# Altium project Luchador Rev 3.2.PrjPcb (part 1 of 4)
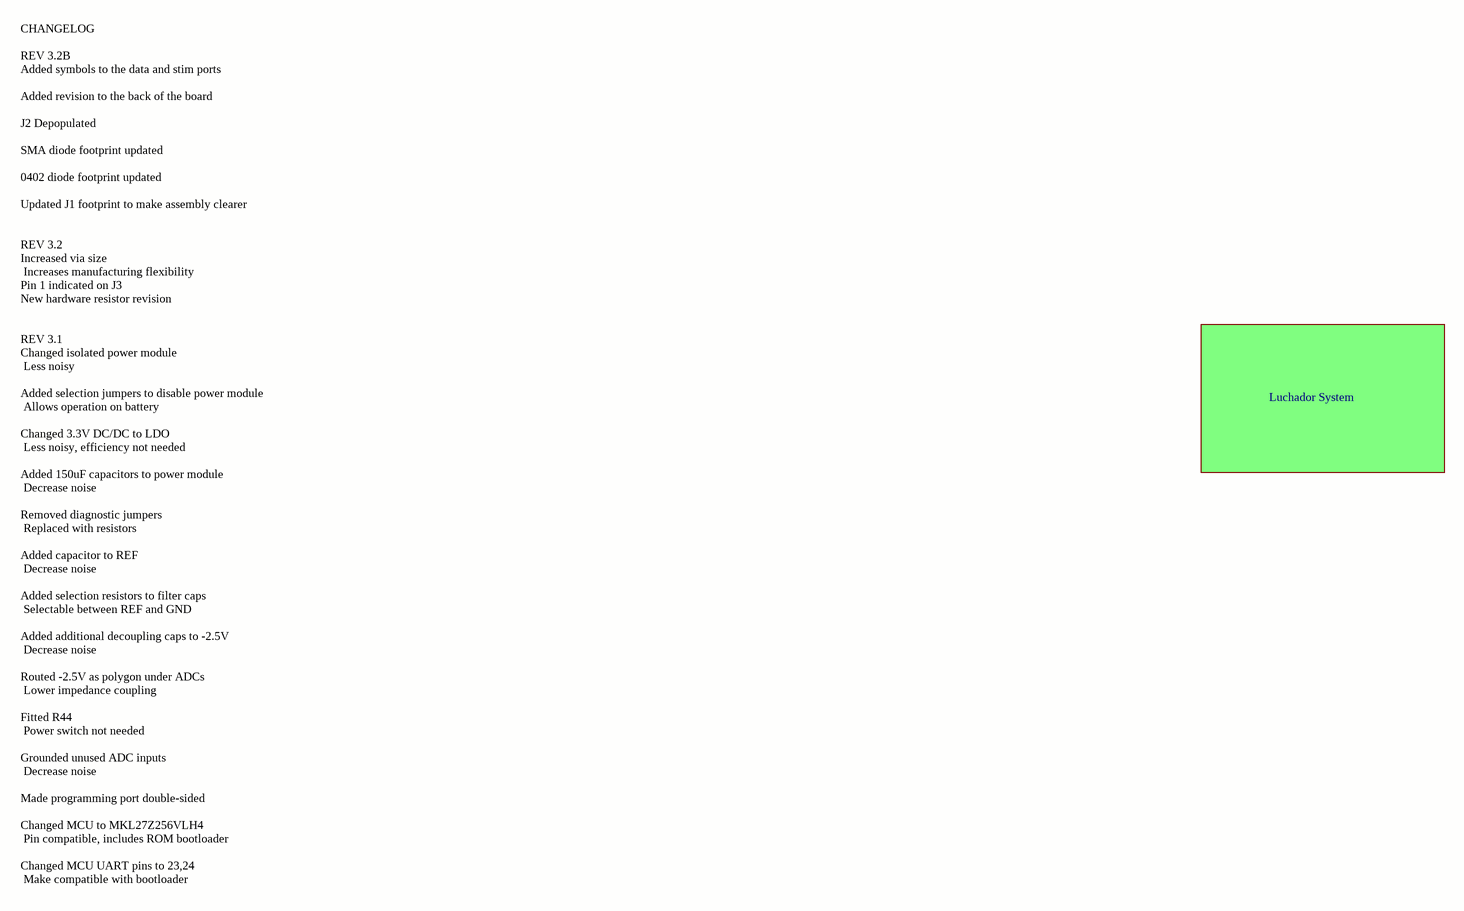
[diagram p0: Cover Sheet.SchDoc]
DocNumberSCH: 650-02461-01; PCBDOC: XXXXXX; PCBPN: 651-02461-01; PCBREV: 3.2b; PRJCOMPANY: X; PRJDATE: 3-15-19; PRJDOC: XXXXXX; PRJENGINEER: N. HAMAN; PRJNAME: AMBER; PRJREV: 3.2b
8 sheets, 149 parts. Net scope: flat (ports and power ports of the same name join across sheets).
Board file: Luchador Pcb.PcbDoc
Sheets:
  Cover Sheet.SchDoc
    Luchador System = System.SchDoc
      Power Supply/Charger = Power Supply.SchDoc
      MCU = Microcontroller.SchDoc
      RTC = Real Time Clock.SchDoc
      MICRO SD = Micro SD.SchDoc
  8CH EEG.SchDoc
  Differential Channel Protection.SchDoc

## Sheet Cover Sheet.SchDoc
size B; SheetNumber: 1; SheetTotal: 11; TitleBlk1Sch: PCBA, LUCHADOR, REV 3.2b, AMBER; TitleBlk2Sch: Luchador System; RevSch: 01; EngDate: 3-15-2019; Eng: Haman/Seto

### Sub-sheets
Luchador System = System.SchDoc: no entries

### Notes on the sheet
- CHANGELOG
  REV 3.2B
  Added symbols to the data and stim ports
  Added revision to the back of the board
  J2 Depopulated
  SMA diode footprint updated
  0402 diode footprint updated
  Updated J1 footprint to make assembly clearer
  REV 3.2
  Increased via size
  Increases manufacturing flexibility
  Pin 1 indicated on J3
  New hardware resistor revision
  REV 3.1
  Changed isolated power module
  Less noisy
  Added selection jumpers to disable power module
  Allows operation on battery
  Changed 3.3V DC/DC to LDO
  Less noisy, efficiency not needed
  Added 150uF capacitors to power module
  Decrease noise
  Removed diagnostic jumpers
  Replaced with resistors
  Added capacitor to REF
  Decrease noise
  Added selection resistors to filter caps
  Selectable between REF and GND
  Added additional decoupling caps to -2.5V
  Decrease noise
  Routed -2.5V as polygon under ADCs
  Lower impedance coupling
  Fitted R44
  Power switch not needed
  Grounded unused ADC inputs
  Decrease noise
  Made programming port double-sided
  Changed MCU to MKL27Z256VLH4
  Pin compatible, includes ROM bootloader
  Changed MCU UART pins to 23,24
  Make compatible with bootloader
  Moved START signal to pin 41
  Original pin was NMI pin
  Added MCU hardware version resistors
  Added force bootloader jumper
  Allows image update without JTAG
  REV 3.0
  New Release
- Title:
- USA
- 100 Mayfield Avenue
- Mountain View, CA 94043
- Variant Name:
- Confidential and Proprietary
- Engineer:
- Date:
- Size:
- B
- Template:
- 992-00283-00 A
- Dwg No:
- Sheet:
- Rev:
- of

## Sheet System.SchDoc
size B; SheetNumber: 2; SheetTotal: 11; TitleBlk1Sch: PCBA, LUCHADOR, REV 3.2b, AMBER; Eng: Haman/Seto; EngDate: 3-15-19; TitleBlk2Sch: System; RevSch: 01
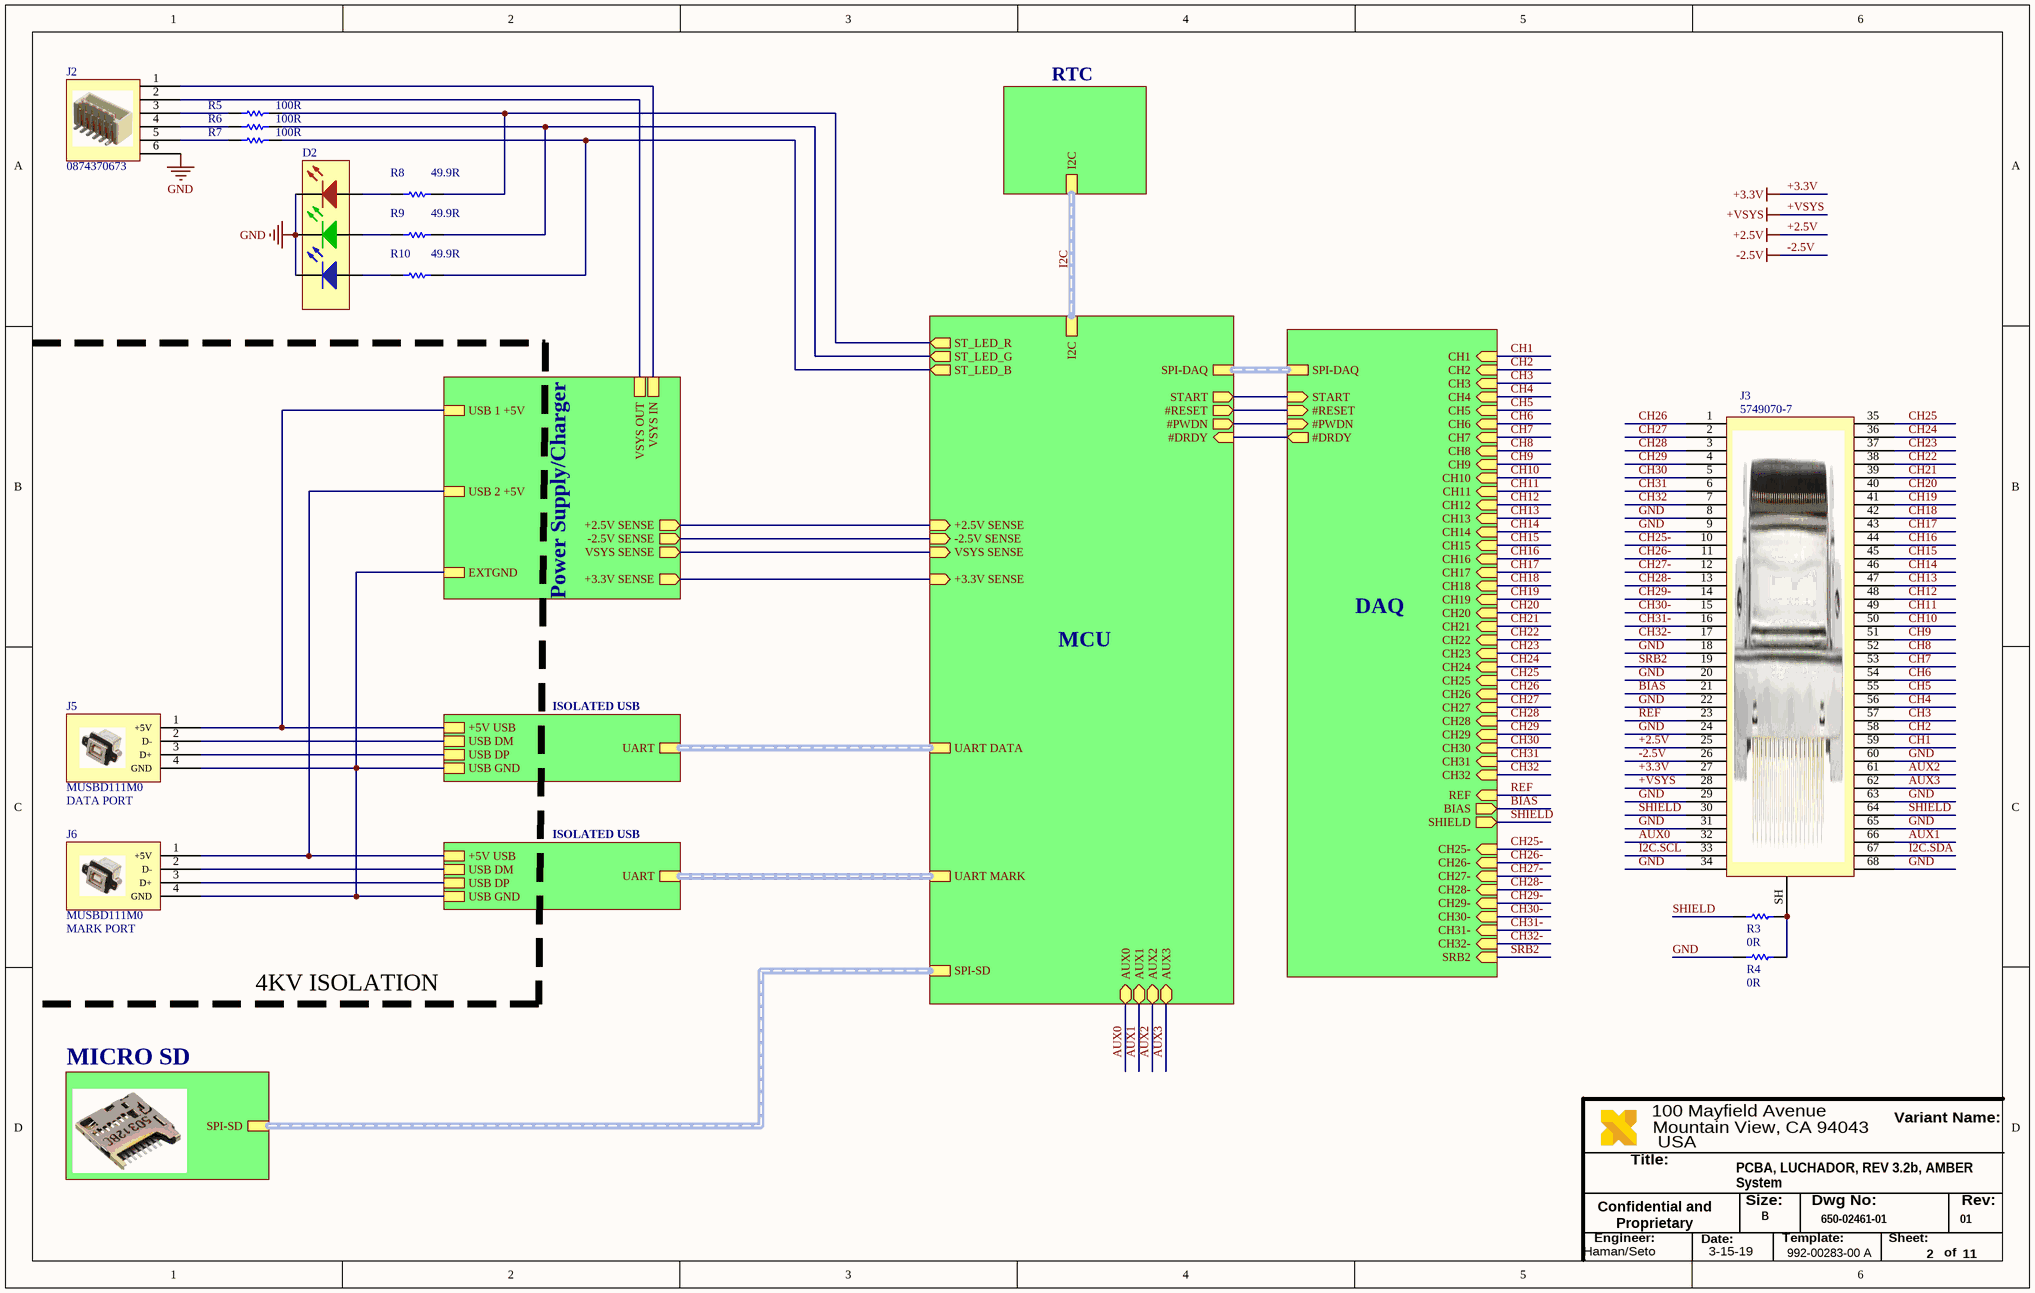
[diagram p1: System.SchDoc]

### Parts
D2  Component_2  [ASMB-TTB0-0A3A2]  (value not drawn)
J2  POWER SWITCH  [0874370673]  (value not drawn)
J3  10268-6212PC  [5749070-7]  (value not drawn)
J5  DATA PORT  [MUSBD111M0]
J6  MARK PORT  [MUSBD111M0]
R3  Resistance (Ohms): 0R  [0402R]  (hidden comment: Res 0805)
R4  Resistance (Ohms): 0R  [0402R]  (hidden comment: Res 0805)
R5  Resistance: 100R  [0402R]  (hidden comment: Res 0805)
R6  Resistance: 100R  [0402R]  (hidden comment: Res 0805)
R7  Resistance: 100R  [0402R]  (hidden comment: Res 0805)
R8  Resistance (Ohms): 49.9R  [0402R]  (hidden comment: Res 0805)
R9  Resistance (Ohms): 49.9R  [0402R]  (hidden comment: Res 0805)
R10  Resistance (Ohms): 49.9R  [0402R]  (hidden comment: Res 0805)

### Sub-sheets
DAQ = DAQ System.SchDoc (file not in this document): REF (in), BIAS (out), SHIELD (out), CH1 (in), CH2 (in), CH3 (in), CH4 (in), CH5 (in), CH6 (in), CH7 (in), CH8 (in), CH9 (in), CH10 (in), CH11 (in), CH12 (in), CH13 (in), CH14 (in), CH15 (in), CH16 (in), CH17 (in), CH18 (in), CH19 (in), CH20 (in), CH21 (in), CH22 (in), CH23 (in), CH24 (in), CH25 (in), CH26 (in), CH27 (in), CH28 (in), CH29 (in), CH30 (in), CH31 (in), CH32 (in), SPI-DAQ (harness SPI-DAQ), CH25- (in), CH26- (in), CH27- (in), CH28- (in), CH29- (in), CH30- (in), CH31- (in), CH32- (in), SRB2 (in), START (in), #RESET (in), #PWDN (in), #DRDY (out)
ISOLATED USB = Isolated USB.SchDoc (file not in this document): +5V USB, USB DM, USB DP, USB GND, UART (harness UART)
ISOLATED USB = Isolated USB.SchDoc (file not in this document): +5V USB, USB DM, USB DP, USB GND, UART (harness UART)
MCU = Microcontroller.SchDoc: I2C (harness I2C), UART DATA (harness UART), UART MARK (harness UART), SPI-DAQ (harness SPI-DAQ), START (out), #RESET (out), #PWDN (out), #DRDY (in), SPI-SD (harness SPI-SD), +2.5V SENSE (in), -2.5V SENSE (in), VSYS SENSE (in), +3.3V SENSE (in), AUX0 (bidir), AUX1 (bidir), AUX2 (bidir), AUX3 (bidir), ST_LED_R (out), ST_LED_G (out), ST_LED_B (out)
MICRO SD = Micro SD.SchDoc: SPI-SD (harness SPI-SD)
Power Supply/Charger = Power Supply.SchDoc: USB 1 +5V, USB 2 +5V, EXTGND, VSYS OUT, VSYS IN, VSYS SENSE (out), +3.3V SENSE (out), +2.5V SENSE (out), -2.5V SENSE (out)
RTC = Real Time Clock.SchDoc: I2C (harness I2C)

### Nets
+2.5V: J3.25
+3.3V: J3.27
+VSYS: J3.28
-2.5V: J3.26
GND: D2.1(K) D2.2(K) D2.3(K) J2.6 J3.8 J3.9 J3.18 J3.20 J3.22 J3.24 J3.29 J3.31 J3.34 J3.60 J3.63 J3.65 J3.68 R4.1
AUX0: J3.32 ; sheet MCU/AUX0
AUX1: J3.66 ; sheet MCU/AUX1
AUX2: J3.61 ; sheet MCU/AUX2
AUX3: J3.62 ; sheet MCU/AUX3
BIAS: J3.21 ; sheet DAQ/BIAS
CH1: J3.59 ; sheet DAQ/CH1
CH2: J3.58 ; sheet DAQ/CH2
CH3: J3.57 ; sheet DAQ/CH3
CH4: J3.56 ; sheet DAQ/CH4
CH5: J3.55 ; sheet DAQ/CH5
CH6: J3.54 ; sheet DAQ/CH6
CH7: J3.53 ; sheet DAQ/CH7
CH8: J3.52 ; sheet DAQ/CH8
CH9: J3.51 ; sheet DAQ/CH9
CH10: J3.50 ; sheet DAQ/CH10
CH11: J3.49 ; sheet DAQ/CH11
CH12: J3.48 ; sheet DAQ/CH12
CH13: J3.47 ; sheet DAQ/CH13
CH14: J3.46 ; sheet DAQ/CH14
CH15: J3.45 ; sheet DAQ/CH15
CH16: J3.44 ; sheet DAQ/CH16
CH17: J3.43 ; sheet DAQ/CH17
CH18: J3.42 ; sheet DAQ/CH18
CH19: J3.41 ; sheet DAQ/CH19
CH20: J3.40 ; sheet DAQ/CH20
CH21: J3.39 ; sheet DAQ/CH21
CH22: J3.38 ; sheet DAQ/CH22
CH23: J3.37 ; sheet DAQ/CH23
CH24: J3.36 ; sheet DAQ/CH24
CH25: J3.35 ; sheet DAQ/CH25
CH25-: J3.10 ; sheet DAQ/CH25-
CH26: J3.1 ; sheet DAQ/CH26
CH26-: J3.11 ; sheet DAQ/CH26-
CH27: J3.2 ; sheet DAQ/CH27
CH27-: J3.12 ; sheet DAQ/CH27-
CH28: J3.3 ; sheet DAQ/CH28
CH28-: J3.13 ; sheet DAQ/CH28-
CH29: J3.4 ; sheet DAQ/CH29
CH29-: J3.14 ; sheet DAQ/CH29-
CH30: J3.5 ; sheet DAQ/CH30
CH30-: J3.15 ; sheet DAQ/CH30-
CH31: J3.6 ; sheet DAQ/CH31
CH31-: J3.16 ; sheet DAQ/CH31-
CH32: J3.7 ; sheet DAQ/CH32
CH32-: J3.17 ; sheet DAQ/CH32-
I2C.SCL: J3.33
I2C.SDA: J3.67
REF: J3.23 ; sheet DAQ/REF
SHIELD: J3.30 J3.64 R3.1 ; sheet DAQ/SHIELD
SRB2: J3.19 ; sheet DAQ/SRB2
NetD2_4: D2.4(A) R8.1
NetD2_5: D2.5(A) R9.1
NetD2_6: D2.6(A) R10.1
NetJ2_1: J2.1 ; sheet Power Supply/Charger/VSYS IN
NetJ2_2: J2.2 ; sheet Power Supply/Charger/VSYS OUT
NetJ2_3: J2.3 R5.1
NetJ2_4: J2.4 R6.1
NetJ2_5: J2.5 R7.1
NetJ3_SH: J3.SH R3.2 R4.2
NetJ5_1: J5.1(+5V) ; sheet Power Supply/Charger/USB 1 +5V, sheet ISOLATED USB/+5V USB
NetJ5_2: J5.2(D-) ; sheet ISOLATED USB/USB DM
NetJ5_3: J5.3(D+) ; sheet ISOLATED USB/USB DP
NetJ5_4: J5.4(GND) J6.4(GND) ; sheet Power Supply/Charger/EXTGND, sheet ISOLATED USB/USB GND, sheet ISOLATED USB/USB GND
NetJ6_1: J6.1(+5V) ; sheet Power Supply/Charger/USB 2 +5V, sheet ISOLATED USB/+5V USB
NetJ6_2: J6.2(D-) ; sheet ISOLATED USB/USB DM
NetJ6_3: J6.3(D+) ; sheet ISOLATED USB/USB DP
NetR5_2: R5.2 R8.2 ; sheet MCU/ST_LED_R
NetR6_2: R6.2 R9.2 ; sheet MCU/ST_LED_G
NetR7_2: R7.2 R10.2 ; sheet MCU/ST_LED_B
(unnamed): sheet Power Supply/Charger/VSYS SENSE, sheet MCU/VSYS SENSE
(unnamed): sheet Power Supply/Charger/+3.3V SENSE, sheet MCU/+3.3V SENSE
(unnamed): sheet Power Supply/Charger/+2.5V SENSE, sheet MCU/+2.5V SENSE
(unnamed): sheet Power Supply/Charger/-2.5V SENSE, sheet MCU/-2.5V SENSE
(unnamed): sheet DAQ/START, sheet MCU/START
(unnamed): sheet DAQ/#RESET, sheet MCU/#RESET
(unnamed): sheet DAQ/#PWDN, sheet MCU/#PWDN
(unnamed): sheet DAQ/#DRDY, sheet MCU/#DRDY

### Buses and harness runs
harness I2C = sheet MCU/I2C = sheet RTC/I2C
harness sheet DAQ/SPI-DAQ = sheet MCU/SPI-DAQ
harness sheet ISOLATED USB/UART = sheet MCU/UART DATA
harness sheet ISOLATED USB/UART = sheet MCU/UART MARK
harness sheet MCU/SPI-SD = sheet MICRO SD/SPI-SD

### Notes on the sheet
- 4KV ISOLATION
- Title:
- USA
- 100 Mayfield Avenue
- Mountain View, CA 94043
- Variant Name:
- Confidential and Proprietary
- Engineer:
- Date:
- Size:
- B
- Template:
- 992-00283-00 A
- Dwg No:
- Sheet:
- Rev:
- of

### Library data of the parts
D2 = Component_2: Manufacturer: Broadcom Avago; Description1: BROADCOM LIMITED   ASMB-TTB0-0A3A2   LED, RGB, Red, Green, Blue, R 790mcd, G 2.4cd, B 500mcd, 115 , R 2.1V, G 3.1V, B 3.1V; Color: Red, Green, Blue (RGB); Lens Transparency: Diffused; Millicandela Rating: 790mcd Red, 2400mcd Green, 500mcd Blue; Lens Style/Size: Round with Flat Top; Voltage - Forward (Vf) (Typ): 2.1V Red, 3.1V Green, 3.1V Blue; Current - Test: 20mA Red, 20mA Green, 20mA Blue; Viewing Angle: 115°; Wavelength - Dominant: 621nm Red, 530nm Green, 470nm Blue; Wavelength - Peak: 635nm Red, 521nm Green, 464nm Blue; Supplier 1: Digi-Key; Supplier Part Number 1: 516-3281-1-ND; Stock 1: 165716; Pricing 1: 1=1.57, 10=1.272, 25=0.9788, 100=0.8809, 250=0.783, 500=0.6656, 1000=0.5481 (USD); Category: Optoelectronics; Family: LED Indication - Discrete; Series: -; Packaging: Tape & Reel (TR); Lens Color: -; Mounting Type: Surface Mount; Features: -; Package / Case: 6-SMD, J-Lead; Supplier Device Package: 6-PLCC; Size / Dimension: 3.50mm L x 3.50mm W; Height (Max): 2.80mm; Manufacturer Part Number: ASMB-TTB0-0A3A2
J2 = 0874370673: Manufacturer: Molex; Description1: Conn Shrouded Header HDR 6 POS 1.5mm Solder ST SMD Embossed T/R; Pitch: 1.5 mm; Number of Contacts: 6; Gender: HDR; Supplier 1: Digi-Key; Supplier Part Number 1: WM7141CT-ND; Stock 1: 9106; Pricing 1: 1=1.29, 10=1.131, 100=0.976 (USD); Type: Shrouded Header; Number of Rows: 1; Contact Plating: Tin Over Nickel; Termination Method: Solder; Category: Connector Headers and PCB Receptacles; Manufacturer Part Number: 0874370673
J3 = 10268-6212PC: Manufacturer: AMP - TE CONNECTIVITY; Supplier 1: Digi-Key; Supplier Part Number 1: A31822-ND; Manufacturer Part Number: 5749070-7; Stock 1: 836; Pricing 1: 1=12.95, 16=11.7763, 32=11.4816, 56=10.5984, 104=10.0096, 256=9.1264, 504=8.5376, 1000=7.831 (USD)
J5 J6 = MUSBD111M0: Manufacturer: Amphenol Commercial Products; Description1: CONN RECPT RUGGED USB B IP67; Connector Type: USB - B; Number of Contacts: 4; Gender: Receptacle; Specifications: USB 2.0; Ingress Protection: IP67 - Dust Tight, Waterproof; Current Rating: 1.5A; Mating Cycles: 1500; Shielding: Shielded; Material Flammability Rating: UL94 V-0; Supplier 1: Digi-Key; Supplier Part Number 1: MUSBD111M0-ND; Manufacturer Part Number: MUSBD111M0; RoHS: RoHS Compliant; Category: Connectors, Interconnects; Stock 1: 4176; Pricing 1: 1=9.81, 10=9.385, 25=8.532, 50=8.1054, 100=7.8921, 250=7.03892, 500=6.6123, 1000=6.162 (USD); Packaging: Bulk; Part Status: Active; Mounting Type: Panel Mount, Through Hole, Right Angle; Mounting Feature: Flange, Horizontal; Termination: Solder; Features: Board Guide; Operating Temperature: -40°C ~ 105°C; Voltage - Rated: -; Contact Finish: Gold; Shell/Shielding Material: Copper Alloy; Insulation Color: White; ComponentLink1URL: https://www.amphenolcanada.com/ProductSearch/drawings/AC/MUSBD111XX.pdf; ComponentLink1Description: https://www.amphenolcanada.com/ProductSearch/drawings/AC/MUSBD111XX.pdf
R3 R4 = Res 0805: Resistor; Manufacturer: Panasonic; Manufacturer Part Number: ERJ-2GE0R00X; Description1: Res Thick Film 0402 0 Ohm Molded SMD Automotive T/R; EDA / CAD Models: Download from Accelerated Designs; Tolerance: Jumper; Power (Watts): 0.1W, 1/10W; Online Catalog: ERJ Series; Other Names: P0.0JDKR; Supplier 1: Digi-Key; Supplier Part Number 1: P0.0JCT-ND; Stock 1: 31263960; Pricing 1: 1=0.1, 10=0.037, 25=0.0268, 50=0.0204, 100=0.015, 250=0.0114, 500=0.0091, 1000=0.0067, 5000=0.0048 (USD); Standard Package: 1; Category: Resistors; Family: Chip Resistor - Surface Mount; Series: ERJ; Packaging: Digi-Reel®; Composition: Thick Film; Features: Automotive AEC-Q200; Temperature Coefficient: -; Operating Temperature: -55°C ~ 155°C; Package / Case: 0402 (1005 Metric); Supplier Device Package: 0402; Size / Dimension: 0.039" L x 0.020" W (1.00mm x 0.50mm); Height: 0.016" (0.40mm); Number of Terminations: 2; ComponentLink1URL: https://datasheet.ciiva.com/48531/aoa0000ce1-48531077.pdf; ComponentLink1Description: https://datasheet.ciiva.com/48531/aoa0000ce1-48531077.pdf; ComponentLink2URL: https://datasheet.ciiva.com/16783/70260739-16783734.pdf; ComponentLink2Description: https://datasheet.ciiva.com/16783/70260739-16783734.pdf; ComponentLink3URL: https://datasheet.ciiva.com/11821/0900766b80f806dd-11821176.pdf; ComponentLink3Description: https://datasheet.ciiva.com/11821/0900766b80f806dd-11821176.pdf; ComponentLink4URL: https://datasheet.ciiva.com/17215/aoa0000ce1-17215386.pdf; ComponentLink4Description: https://datasheet.ciiva.com/17215/aoa0000ce1-17215386.pdf; ComponentLink5URL: https://datasheet.ciiva.com/43460/1678796-43460347.pdf; ComponentLink5Description: https://datasheet.ciiva.com/43460/1678796-43460347.pdf; ComponentLink6URL: https://datasheet.ciiva.com/5959/1678796-5959692.pdf; ComponentLink6Description: https://datasheet.ciiva.com/5959/1678796-5959692.pdf; ComponentLink7URL: https://datasheet.ciiva.com/30097/4aoa0000ce1-30097116.pdf; ComponentLink7Description: https://datasheet.ciiva.com/30097/4aoa0000ce1-30097116.pdf; ComponentLink8URL: https://datasheet.ciiva.com/28695/1678796-28695758.pdf; ComponentLink8Description: https://datasheet.ciiva.com/28695/1678796-28695758.pdf; ComponentLink9URL: https://datasheet.ciiva.com/46389/1678796-46389518.pdf; ComponentLink9Description: https://datasheet.ciiva.com/46389/1678796-46389518.pdf; ComponentLink10URL: https://datasheet.ciiva.com/16778/70260739-16778335.pdf; ComponentLink10Description: https://datasheet.ciiva.com/16778/70260739-16778335.pdf
R5-R7 = Res 0805: Resistor; Manufacturer: Panasonic; Manufacturer Part Number: ERJ-2RKF1000X; Description1: Res Thick Film 0402 100 Ohm 1% 0.1W(1/10W) ±100ppm/C Molded SMD Automotive T/R; Rated Power: 0.1 W; Tolerance (%): ±1 %; Temp Coefficient: ±100 ppm/°C; Supplier 1: Digi-Key; Supplier Part Number 1: P100LCT-ND; Stock 1: 14075966; Pricing 1: 1=0.1, 10=0.056, 100=0.0227, 1000=0.0102, 2500=0.0089, 5000=0.0073 (USD); Size Code: 0402; ComponentLink1URL: https://datasheet.ciiva.com/27056/2007311-27056035.pdf; ComponentLink1Description: https://datasheet.ciiva.com/27056/2007311-27056035.pdf; ComponentLink2URL: https://datasheet.ciiva.com/11821/0900766b80f80784-11821173.pdf; ComponentLink2Description: https://datasheet.ciiva.com/11821/0900766b80f80784-11821173.pdf; ComponentLink3URL: https://datasheet.ciiva.com/46372/1678782-46372741.pdf; ComponentLink3Description: https://datasheet.ciiva.com/46372/1678782-46372741.pdf; ComponentLink4URL: https://datasheet.ciiva.com/16199/aoa0000ce2-16199575.pdf; ComponentLink4Description: https://datasheet.ciiva.com/16199/aoa0000ce2-16199575.pdf; ComponentLink5URL: https://datasheet.ciiva.com/43467/1678782-43467223.pdf; ComponentLink5Description: https://datasheet.ciiva.com/43467/1678782-43467223.pdf; ComponentLink6URL: https://datasheet.ciiva.com/30260/aoa0000ce2-30260809.pdf; ComponentLink6Description: https://datasheet.ciiva.com/30260/aoa0000ce2-30260809.pdf; ComponentLink7URL: https://datasheet.ciiva.com/9186/aoa0000ce2-9186683.pdf; ComponentLink7Description: https://datasheet.ciiva.com/9186/aoa0000ce2-9186683.pdf; ComponentLink8URL: https://datasheet.ciiva.com/16776/70260748-16776427.pdf; ComponentLink8Description: https://datasheet.ciiva.com/16776/70260748-16776427.pdf; ComponentLink9URL: https://datasheet.ciiva.com/48531/aoa0000ce2-48531067.pdf; ComponentLink9Description: https://datasheet.ciiva.com/48531/aoa0000ce2-48531067.pdf; ComponentLink10URL: https://datasheet.ciiva.com/17207/aoa0000ce2-17207980.pdf; ComponentLink10Description: https://datasheet.ciiva.com/17207/aoa0000ce2-17207980.pdf; ComponentLink11URL: https://datasheet.ciiva.com/7830/426256-7830973.pdf; ComponentLink11Description: https://datasheet.ciiva.com/7830/426256-7830973.pdf; ComponentLink12URL: https://datasheet.ciiva.com/16522/aoa0000ce2-16522621.pdf; ComponentLink12Description: https://datasheet.ciiva.com/16522/aoa0000ce2-16522621.pdf; ComponentLink13URL: https://datasheet.ciiva.com/28514/1678782-28514175.pdf; ComponentLink13Description: https://datasheet.ciiva.com/28514/1678782-28514175.pdf
R8-R10 = Res 0805: Resistor; Manufacturer: Yageo; Manufacturer Part Number: RC0402FR-0749R9L; Description1: RES SMD 49.9 OHM 1% 1/16W 0402; Product Training Modules: Chip Resistor; Catalog Drawings: Thick Film Resistor Top Thick Film Resistor Side; HTML Datasheet: RC Series, L Suffix Datasheet.html; EDA / CAD Models: Download from Accelerated Designs; Tolerance: ±1%; Power (Watts): 0.063W, 1/16W; Temperature Coefficient: ±100ppm/°C; Online Catalog: RC0402 Series; Kits: PHL1-KIT-ND  - RESISTOR KIT 1-75 1/16W 850PCS; Other Names: 311-49.9LRCT; Supplier 1: Digi-Key; Supplier Part Number 1: 311-49.9LRCT-ND; Stock 1: 22199663; Pricing 1: 1=0.1, 10=0.022, 100=0.009, 1000=0.004, 2500=0.0035, 5000=0.0029 (USD); Standard Package: 1; Category: Resistors; Family: Chip Resistor - Surface Mount; Series: RC; Packaging: Cut Tape (CT); Composition: Thick Film; Features: Moisture Resistant; Operating Temperature: -55°C ~ 155°C; Package / Case: 0402 (1005 Metric); Supplier Device Package: 0402; Size / Dimension: 0.039" L x 0.020" W (1.00mm x 0.50mm); Height: 0.016" (0.40mm); Number of Terminations: 2